# EAGLE design flanger (EAGLE 9.6.2)
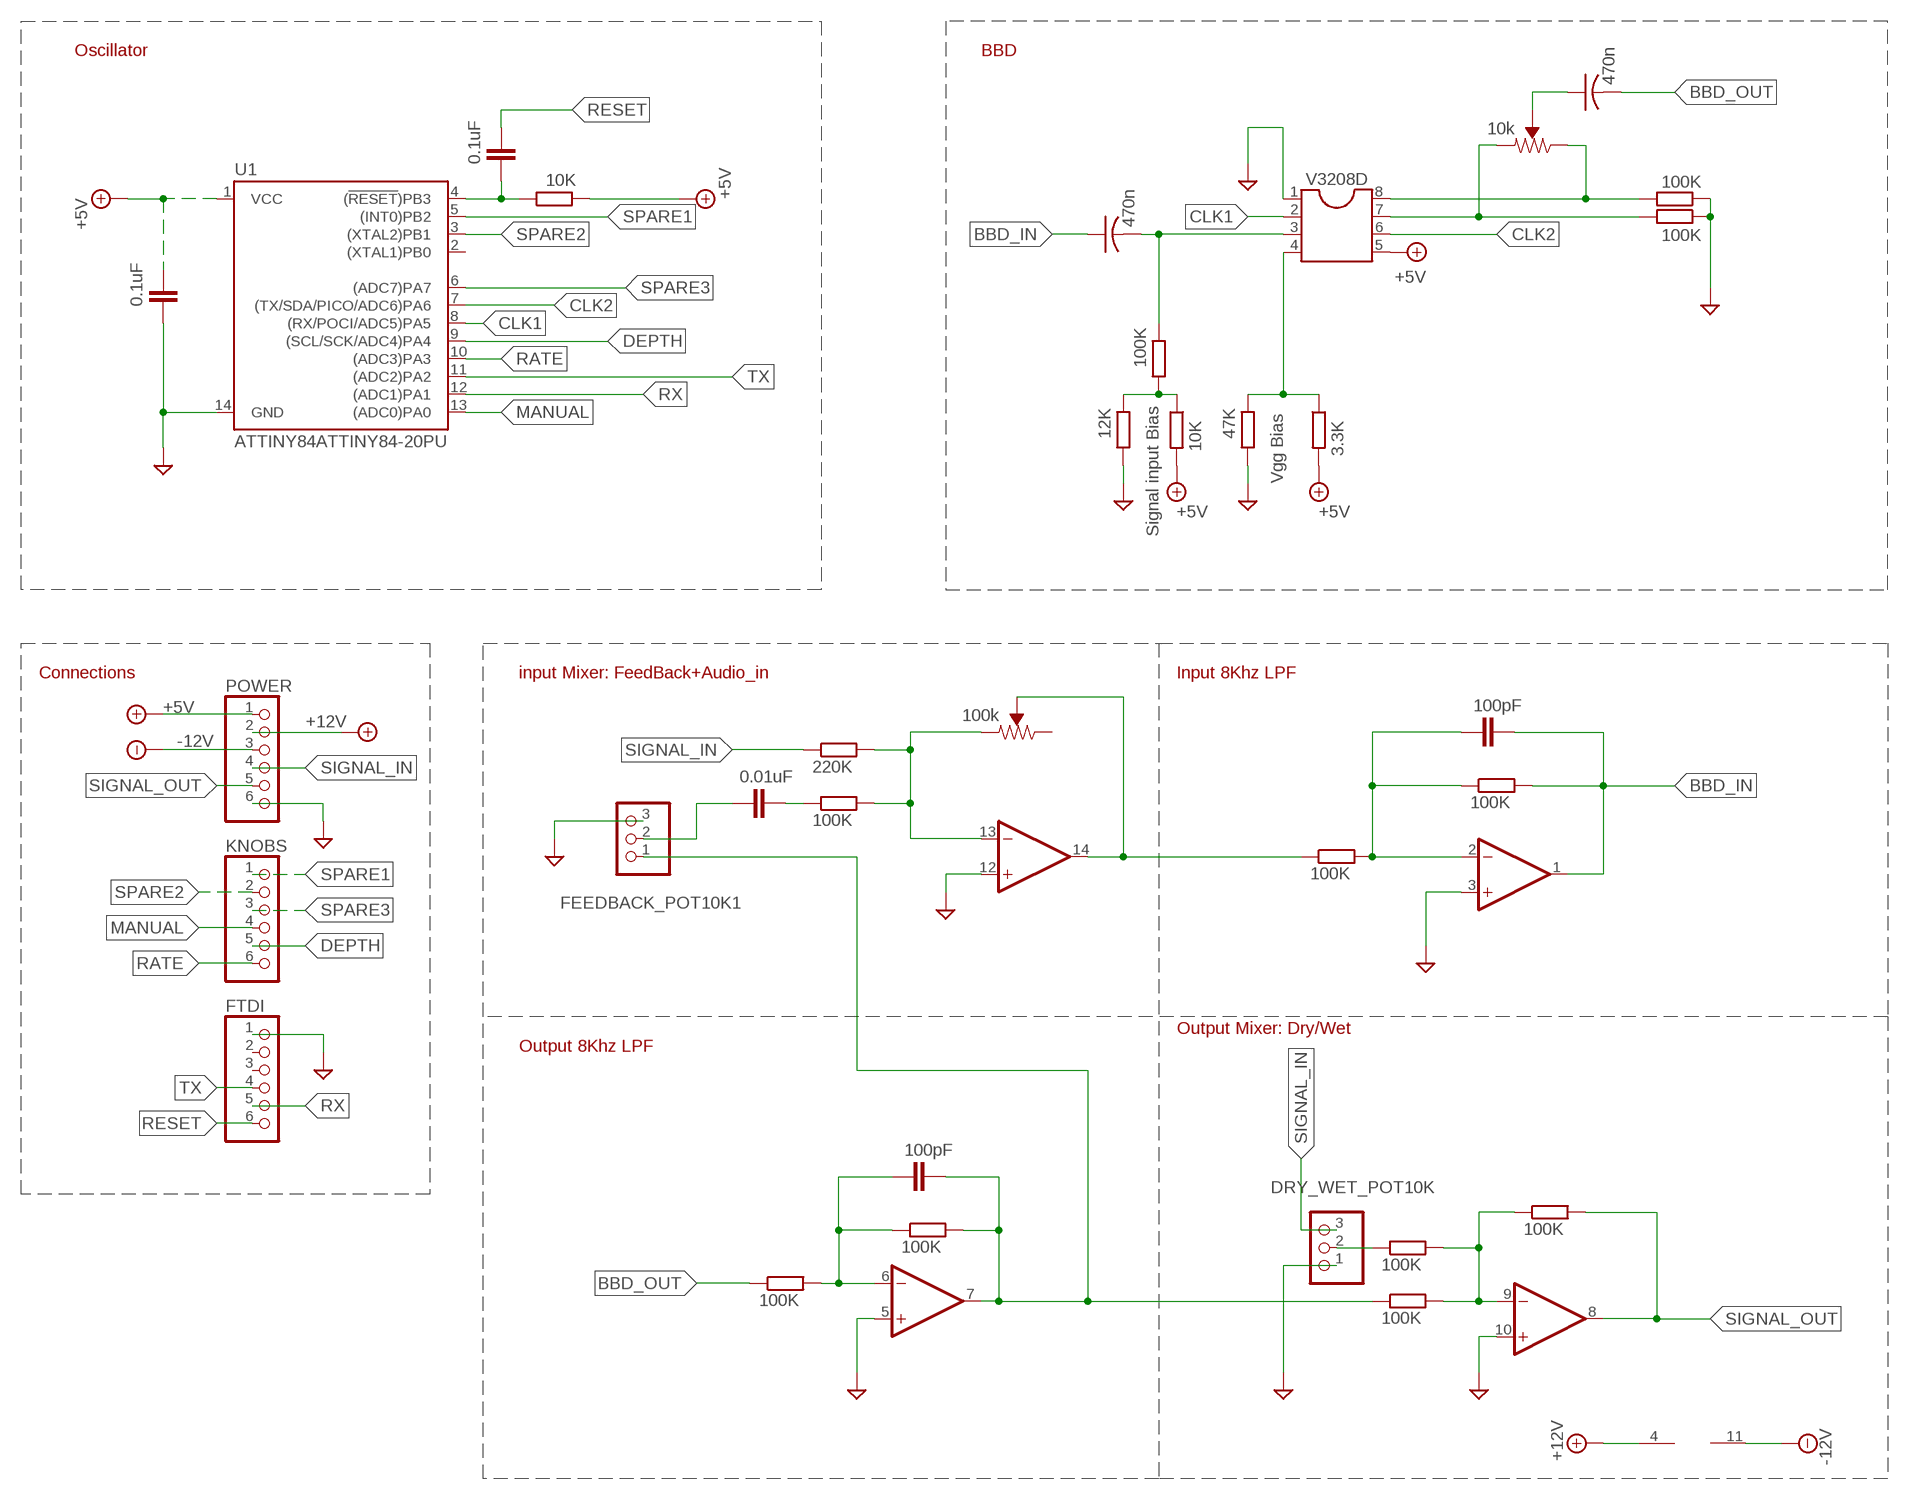
[diagram p0: schematic, sheet 1]

## Parts
C1  470n  C-US050-025X075  [C050-025X075]
C2  470n  C-US050-025X075  [C050-025X075]
C3  100pF  C5/2.5  [C5B2.5]
C4  100pF  C5/2.5  [C5B2.5]
C5  0.01uF  C5/2.5  [C5B2.5]
C6  0.1uF  C5/2.5  [C5B2.5]
C7  0.1uF  C5/2.5  [C5B2.5]
DRY_WET_POT10K  PINHD-1X3  [1X03]
FEEDBACK_POT10K1  PINHD-1X3  [1X03]
FTDI  PINHD-1X6  [1X06]
IC1  LM324N  [DIL14]
KNOBS  PINHD-1X6  [1X06]
POWER  PINHD-1X6  [1X06]
R1  12K  R-EU_0207/10  [0207/10]
R2  100K  R-EU_0207/10  [0207/10]
R3  10K  R-EU_0207/10  [0207/10]
R4  47K  R-EU_0207/10  [0207/10]
R5  3.3K  R-EU_0207/10  [0207/10]
R6  100K  R-EU_0207/10  [0207/10]
R7  100K  R-EU_0207/10  [0207/10]
R8  100K  R-EU_0207/10  [0207/10]
R9  100K  R-EU_0207/10  [0207/10]
R10  100K  R-EU_0207/10  [0207/10]
R11  100K  R-EU_0207/10  [0207/10]
R13  100K  R-EU_0207/10  [0207/10]
R14  100K  R-EU_0207/10  [0207/10]
R15  220K  R-EU_0207/10  [0207/10]
R16  100K  R-EU_0207/10  [0207/10]
R17  100K  R-EU_0207/10  [0207/10]
R18  10K  R-EU_0207/10  [0207/10]
U1  ATTINY84ATTINY84-20PU  [DIP14]
V3208D  DIL8  [DIL08]
VR1  10k  TRIMPOT-PTH-10MM-KNOB-1/2W-10%  [TRIMPOT-PTH-3386U]
VR2  100k  TRIMPOT-PTH-10MM-KNOB-1/2W-10%  [TRIMPOT-PTH-3386U]

## Nets
+5V: C6.2 POWER.1 R3.2 R5.2 R18.2 U1.1(VCC) V3208D.5
+12V: IC1.4(P:V+) POWER.2
-12V: IC1.11(P:V-) POWER.3
BBD_IN: C1.1 C3.2 IC1.1(A:OUT) R8.2
BBD_OUT: C2.2 R11.1
CLK1: U1.8((RX/POCI/ADC5)PA5) V3208D.2
CLK2: U1.7((TX/SDA/PICO/ADC6)PA6) V3208D.6
DEPTH: KNOBS.5 U1.9((SCL/SCK/ADC4)PA4)
GND: C6.1 DRY_WET_POT10K.1 FEEDBACK_POT10K1.3 FTDI.1 IC1.3(A:+IN) IC1.5(B:+IN) IC1.10(C:+IN) IC1.12(D:+IN) POWER.6 R1.1 R4.1 R6.1 R7.1 U1.14(GND) V3208D.1
MANUAL: KNOBS.4 U1.13((ADC0)PA0)
N$1: R6.2 V3208D.8 VR1.3(CW)
N$2: R7.2 V3208D.7 VR1.1(CCW)
N$3: C1.2 R2.2 V3208D.3
N$4: C2.1 VR1.2(WIPER)
N$5: R1.2 R2.1 R3.1
N$6: R4.2 R5.1 V3208D.4
N$7: IC1.13(D:-IN) R15.2 R16.2 VR2.1(CCW)
N$8: C3.1 IC1.2(A:-IN) R8.1 R9.2
N$9: C4.1 IC1.6(B:-IN) R10.1 R11.2
N$10: DRY_WET_POT10K.2 R17.1
N$11: IC1.14(D:OUT) R9.1 VR2.2(WIPER)
N$12: C4.2 FEEDBACK_POT10K1.1 IC1.7(B:OUT) R10.2 R14.1
N$13: IC1.9(C:-IN) R13.1 R14.2 R17.2
N$14: C5.2 R16.1
N$15: C5.1 FEEDBACK_POT10K1.2
N$16: C7.1 R18.1 U1.4((!RESET!)PB3)
RATE: KNOBS.6 U1.10((ADC3)PA3)
RESET: C7.2 FTDI.6
RX: FTDI.5 U1.12((ADC1)PA1)
SIGNAL_IN: DRY_WET_POT10K.3 POWER.4 R15.1
SIGNAL_OUT: IC1.8(C:OUT) POWER.5 R13.2
SPARE1: KNOBS.1 U1.5((INT0)PB2)
SPARE2: KNOBS.2 U1.3((XTAL2)PB1)
SPARE3: KNOBS.3 U1.6((ADC7)PA7)
TX: FTDI.4 U1.11((ADC2)PA2)
Unconnected: FTDI.2 FTDI.3 U1.2((XTAL1)PB0) VR2.3(CW)

## Notes on the sheet
- Oscillator | BBD
- Vgg Bias
- Signal input Bias
- Connections | input Mixer: FeedBack+Audio_in | Input 8Khz LPF
- Output Mixer: Dry/Wet
- Output 8Khz LPF

## Library data of the parts
C1 C2 = adafruit:C-US: CAPACITOR, American symbol
C3-C7 = capacitor-wima:C: CAPACITOR naming: grid - package width
DRY_WET_POT10K FEEDBACK_POT10K1 = adafruit:PINHD-1X3: PIN HEADER
FTDI KNOBS POWER = adafruit:PINHD-1X6: PIN HEADER
IC1 = linear:LM324: OP AMP
R1-R11 R13-R18 = rcl:R-EU_: RESISTOR, European symbol; SPICEPREFIX: R
U1 = SparkFun-IC-Microcontroller:ATTINY84: Atmel 14-pin 2/4/8kB flash uC Datasheet <https://cdn.sparkfun.com/datasheets/Widgets/doc8006.pdf> SparkFun Products Tiny AVR Programmer <https://www.sparkfun.com/products/11801> (PGM-11801) SparkFun Servo Trigger - Continuous Rotation <https://www.sparkfun.com/products/13872> (WIG-13872) SparkFun Servo Trigger <https://www.sparkfun.com/products/13118> (WIG-13118)
V3208D = ic-package:DIL8: Dual In Line / Socket
VR1 = SparkFun-Resistors:TRIMPOT: Trimming Potentiometer (Trimpot) Three-terminal potentiometers, with an adjustable wiper and two adjustable resistors. A pot can be used to create a configurable voltage divider, or as a variable resistor. "Trimpots" are a subset of potentiometers, usually intended for "set-and-forget" applications. They're often more delicate than standard potentiometers - rated for fewer turns. Variants PTH-KNOB - PTH Trimpot w/ finger-adjustable knob Trimpot 10K with Knob <https://www.sparkfun.com/products/9806> (COM-09806) Datasheet <http://www.sparkfun.com/datasheets/Components/General/TSR-3386.pdf> SMD-3MM-CLOSED-FRAME - SMD 3mm Square Closed-Frame Trimpot Used on e.g. EasyDriver - Stepper Motor Driver <https://www.sparkfun.com/products/12779> Datasheet <http://www.bitechnologies.com/pdfs/22.pdf> (22AR10KTR) SMD-5MM - SMD 5mm Square Closed-Frame Trimpot Used on e.g. IOIO-OTG - V2.2 <https://www.sparkfun.com/products/13613> Datasheet <http://www.vishay.com/docs/51008/ts53.pdf> (TS53YL502MR10) SMD-3MM-1/10W-25% - 3mm Square Open-Frame Trimpot Used on e.g. SparkFun Shapeoko <https://www.sparkfun.com/products/13899> Datasheet <http://www.bourns.com/docs/Product-Datasheets/TC33.pdf> (TC33X-2-103E); PROD_ID: RES-09730; SF_SKU: COM-09806
VR2 = SparkFun-Resistors:TRIMPOT: Trimming Potentiometer (Trimpot) Three-terminal potentiometers, with an adjustable wiper and two adjustable resistors. A pot can be used to create a configurable voltage divider, or as a variable resistor. "Trimpots" are a subset of potentiometers, usually intended for "set-and-forget" applications. They're often more delicate than standard potentiometers - rated for fewer turns. Variants PTH-KNOB - PTH Trimpot w/ finger-adjustable knob Trimpot 10K with Knob <https://www.sparkfun.com/products/9806> (COM-09806) Datasheet <http://www.sparkfun.com/datasheets/Components/General/TSR-3386.pdf> SMD-3MM-CLOSED-FRAME - SMD 3mm Square Closed-Frame Trimpot Used on e.g. EasyDriver - Stepper Motor Driver <https://www.sparkfun.com/products/12779> Datasheet <http://www.bitechnologies.com/pdfs/22.pdf> (22AR10KTR) SMD-5MM - SMD 5mm Square Closed-Frame Trimpot Used on e.g. IOIO-OTG - V2.2 <https://www.sparkfun.com/products/13613> Datasheet <http://www.vishay.com/docs/51008/ts53.pdf> (TS53YL502MR10) SMD-3MM-1/10W-25% - 3mm Square Open-Frame Trimpot Used on e.g. SparkFun Shapeoko <https://www.sparkfun.com/products/13899> Datasheet <http://www.bourns.com/docs/Product-Datasheets/TC33.pdf> (TC33X-2-103E); PROD_ID: RES-09730; SF_SKU: COM-09806; VALUE: 10k

## Board
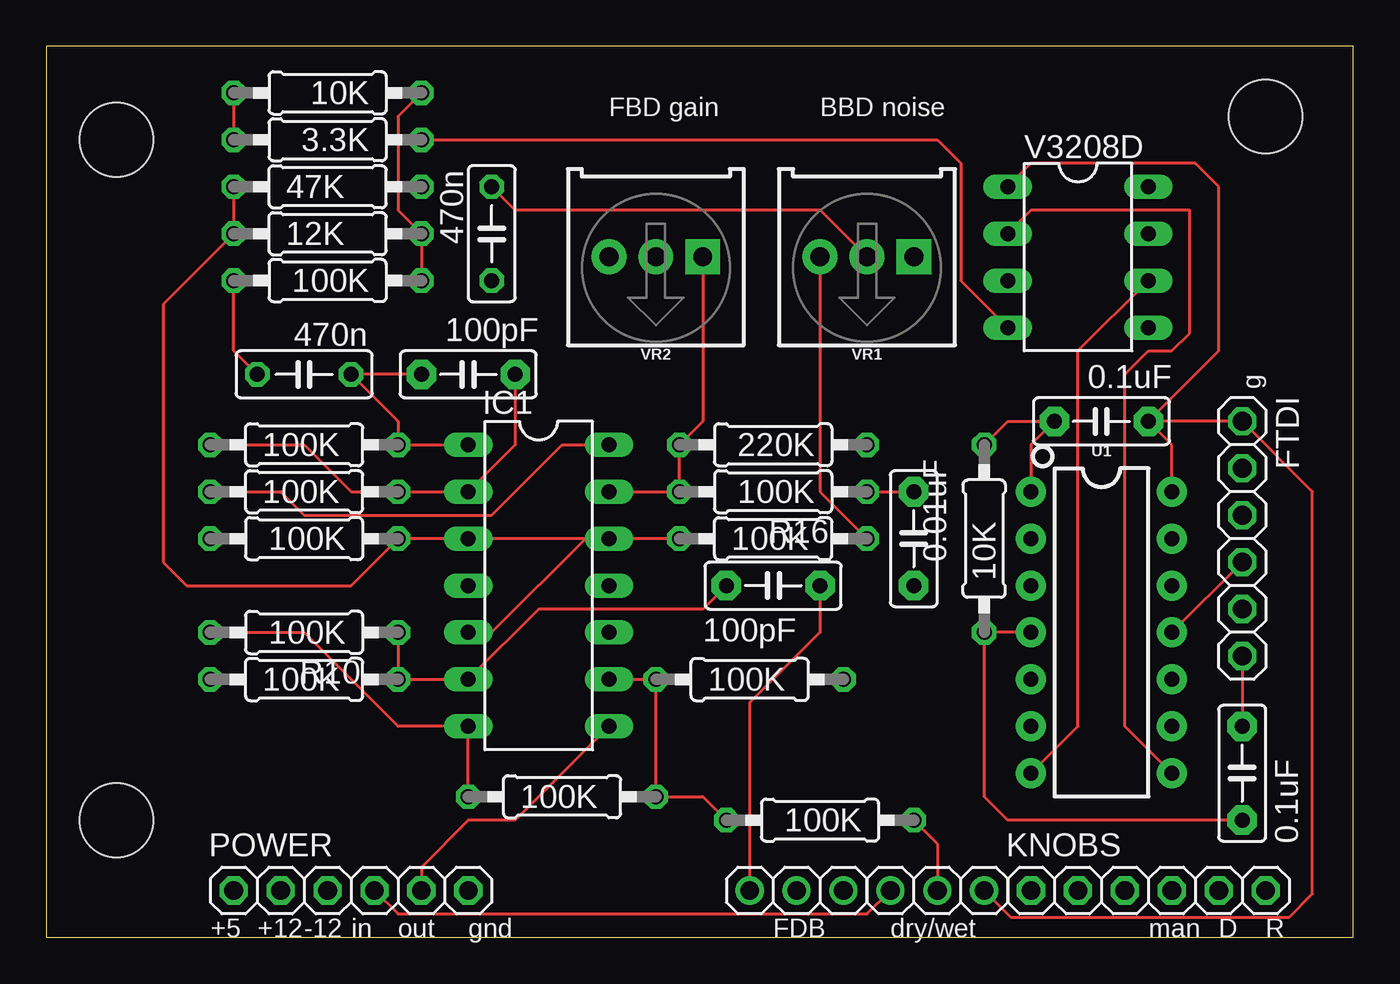
[diagram p1: board, top side]
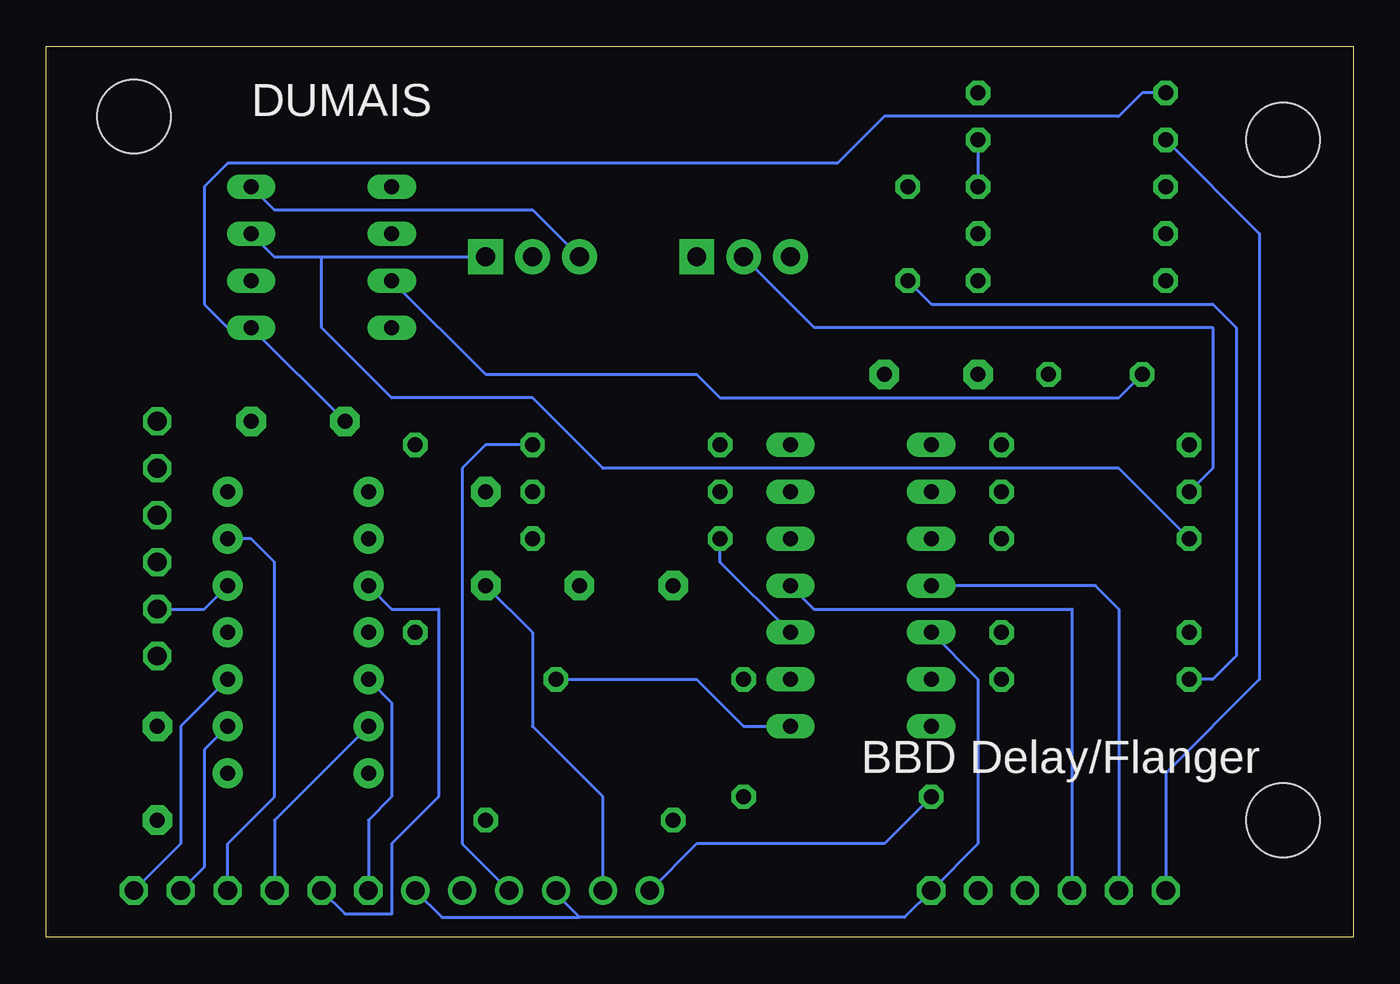
[diagram p2: board, bottom side, seen from below]

Size 70.79 x 48.25 mm. Coordinates in mm from the lower left corner, seen from the top.
Outline: 0,0 70.79,0 70.79,48.25 0,48.25 0,0
Copper layers (1*16): Top 0.035mm / dielectric 1.5mm / Bottom 0.035mm
Design rules "default": minimum track width 6mil, minimum drill 0.35mm, track to track 6mil, track to pad 6mil, pad to pad 6mil, via to via 6mil, smd to smd 6mil, copper to edge 40mil, drill to drill 6mil, minimum pad ring 10mil, minimum via ring 8mil, stop-mask expansion 4mil, vias tented up to drill 0mil, thermal gap 10mil
Holes 4 mm at 3.81,6.35 3.81,43.18 66.04,44.45

### Footprints (pad centres in the part's own frame; a part is rotated, then mirrored left to right if it is on the bottom)
C050-025X075 = drill 0.813 octagon: 1 -2.54,0; 2 2.54,0
C5B2.5 = drill 0.813 pad 1.6 octagon: 1 -2.54,0; 2 2.54,0
1X03 = drill 1.016: 1 -2.54,0; 2 0,0; 3 2.54,0
1X06 = drill 1.016 octagon: 1 -6.35,0; 2 -3.81,0; 3 -1.27,0; 4 1.27,0; 5 3.81,0; 6 6.35,0
DIL14 = drill 0.813 long: 1 -7.62,-3.81; 2 -5.08,-3.81; 3 -2.54,-3.81; 4 0,-3.81; 5 2.54,-3.81; 6 5.08,-3.81; 7 7.62,-3.81; 8 7.62,3.81; 9 5.08,3.81; 10 2.54,3.81; 11 0,3.81; 12 -2.54,3.81; 13 -5.08,3.81; 14 -7.62,3.81
0207/10 = drill 0.813 octagon: 1 -5.08,0; 2 5.08,0
DIP14 = drill 0.813 pad 1.626: 1 -7.62,-3.81; 2 -5.08,-3.81; 3 -2.54,-3.81; 4 0,-3.81; 5 2.54,-3.81; 6 5.08,-3.81; 7 7.62,-3.81; 8 7.62,3.81; 9 5.08,3.81; 10 2.54,3.81; 11 0,3.81; 12 -2.54,3.81; 13 -5.08,3.81; 14 -7.62,3.81
DIL08 = drill 0.813 long: 1 -3.81,-3.81; 2 -1.27,-3.81; 3 1.27,-3.81; 4 3.81,-3.81; 5 3.81,3.81; 6 1.27,3.81; 7 -1.27,3.81; 8 -3.81,3.81
TRIMPOT-PTH-3386U = drill 1.016 pad 1.88 square: 1 -2.54,-0.015 | drill 1.016 pad 1.88: 2 0,-0.015; 3 2.54,-0.015

### Placement (x,y rotation side)
C1  13.97,30.48 180 top
C2  24.13,38.1 270 top
C3  22.86,30.48 180 top
C4  39.37,19.05 0 top
C5  46.99,21.59 90 top
C6  57.15,27.94 180 top
C7  64.77,8.89 90 top
DRY_WET_POT10K  48.26,2.54 180 top
FEEDBACK_POT10K1  40.64,2.54 0 top
FTDI  64.77,21.59 270 top
IC1  26.67,19.05 270 top
KNOBS  59.69,2.54 0 top
POWER  16.51,2.54 0 top
R1  15.24,38.1 0 top
R2  15.24,35.56 180 top
R3  15.24,45.72 180 top
R4  15.24,40.64 0 top
R5  15.24,43.18 180 top
R6  39.37,21.59 0 top
R7  13.97,21.59 180 top
R8  13.97,26.67 0 top
R9  13.97,24.13 0 top
R10  13.97,16.51 180 top
R11  13.97,13.97 0 top
R13  38.1,13.97 0 top
R14  27.94,7.62 0 top
R15  39.37,26.67 180 top
R16  39.37,24.13 180 top
R17  41.91,6.35 180 top
R18  50.8,21.59 90 top
U1  57.15,16.51 270 top
V3208D  55.88,36.83 270 top
VR1  44.45,36.83 180 top
VR2  33.02,36.83 180 top

### Tracks (layer width: path | path; a pad name or v marks a point on that pad's centre or on a via)
+5V
  Top 0.152: U1.1 53.34,26.67 C6.2 52.07,27.94 R18.2 | R3.2 R5.2
  Bottom 0.152: R5.2 5.08,38.1 5.08,13.97 10.16,8.89 POWER.1 | C6.2 V3208D.5 60.96,33.02 62.23,34.29 62.23,40.64 60.96,41.91 27.94,41.91 25.4,44.45 12.7,44.45 11.43,45.72 R3.2
+12V
  Bottom 0.152: POWER.2 12.7,17.78 13.97,19.05 IC1.4
-12V
  Bottom 0.152: IC1.11 29.21,17.78 15.24,17.78 POWER.3
BBD_IN
  Top 0.152: IC1.1 R8.2 19.05,27.94 C1.1 C3.2
BBD_OUT
  Bottom 0.152: C2.2 22.86,34.29 7.62,34.29 6.35,33.02 6.35,15.24 7.62,13.97 R11.1
CLK1
  Top 0.152: U1.8 58.42,11.43 58.42,30.48 59.69,31.75 60.96,31.75 61.92,32.72 61.92,39.37 53.34,39.37 V3208D.2
CLK2
  Top 0.152: U1.7 55.88,11.43 55.88,31.75 V3208D.6
DEPTH
  Bottom 0.152: U1.9 62.23,10.16 62.23,3.81 KNOBS.5
GND
  Top 0.152: R6.1 IC1.12 | R4.1 R1.1 6.35,34.29 6.35,20.32 7.62,19.05 16.51,19.05 R7.1 IC1.3 IC1.12 | U1.14 60.96,26.67 C6.1 | IC1.12 29.21,21.59 24.13,16.51 IC1.5 | DRY_WET_POT10K.1 52.25,1.09 67.31,1.09 68.58,2.36 68.58,24.13 FTDI.1 C6.1 | C6.1 63.5,31.75 63.5,40.64 62.23,41.91 53.34,41.91 V3208D.1
  Bottom 0.152: IC1.10 34.29,20.32 R6.1 | 41.91,1.09 24.31,1.09 POWER.6 20.32,5.08 20.32,13.97 IC1.5 | 41.91,1.09 43.18,2.36 FEEDBACK_POT10K1.3 | DRY_WET_POT10K.1 49.35,1.09 41.91,1.09
MANUAL
  Bottom 0.152: KNOBS.4 60.96,5.08 58.42,7.62 58.42,20.32 59.69,21.59 U1.13
N$1
  Top 0.152: VR1.3 41.91,24.13 R6.2
  Bottom 0.152: VR1.3 44.44,39.37 58.42,39.37 V3208D.8
N$2
  Bottom 0.152: R7.2 12.7,25.4 40.64,25.4 44.45,29.21 52.07,29.21 55.88,33.02 55.88,36.83 | VR1.1 47.01,36.83 55.88,36.83 | V3208D.7 58.42,36.83 55.88,36.83
N$3
  Top 0.152: C1.2 10.16,31.75 R2.2
  Bottom 0.152: V3208D.3 46.99,30.48 35.56,30.48 34.29,29.21 12.7,29.21 C1.2
N$4
  Top 0.152: VR1.2 41.92,39.37 25.4,39.37 C2.1
N$5
  Top 0.152: R2.1 R1.2 19.05,39.37 19.05,44.45 R3.1
N$6
  Top 0.152: R5.1 48.26,43.18 49.53,41.91 49.53,35.56 V3208D.4
  Bottom 0.152: R5.1 R4.2
N$7
  Top 0.152: IC1.13 R16.2 R15.2 35.56,27.94 VR2.1
N$8
  Top 0.152: R8.1 13.97,26.67 16.51,24.13 R9.2 IC1.2 25.4,26.67 C3.1
N$9
  Top 0.152: C4.1 35.56,17.78 26.67,17.78 IC1.6 R11.2 R10.1
N$10
  Top 0.152: R17.1 48.26,5.08 DRY_WET_POT10K.2
N$11
  Top 0.152: R9.1 12.7,24.13 13.97,22.86 24.13,22.86 27.94,26.67 IC1.14
  Bottom 0.152: R9.1 7.62,25.4 7.62,33.02 29.2,33.02 VR2.2
N$12
  Top 0.152: R14.1 IC1.7 19.05,11.43 13.97,16.51 R10.2 | C4.2 41.91,16.51 38.1,12.7 FEEDBACK_POT10K1.1
  Bottom 0.152: R14.1 25.4,5.08 35.56,5.08 FEEDBACK_POT10K1.1
N$13
  Top 0.152: IC1.9 R13.1 R14.2 35.56,7.62 R17.2
N$14
  Top 0.152: R16.1 C5.2
N$15
  Bottom 0.152: FEEDBACK_POT10K1.2 40.64,7.62 44.45,11.43 44.45,16.51 C5.1
N$16
  Top 0.152: U1.4 R18.1 50.8,7.62 52.07,6.35 C7.1
RATE
  Bottom 0.152: U1.10 63.5,11.43 63.5,5.08 KNOBS.6
RESET
  Top 0.152: FTDI.6 C7.2
RX
  Bottom 0.152: FTDI.5 62.23,17.78 U1.12
SIGNAL_IN
  Top 0.152: POWER.4 19.05,1.27 44.45,1.27 DRY_WET_POT10K.3
  Bottom 0.152: R15.1 46.99,26.67 48.26,25.4 48.26,5.08 DRY_WET_POT10K.3
SIGNAL_OUT
  Top 0.152: IC1.8 25.4,6.35 22.86,6.35 20.32,3.81 POWER.5
  Bottom 0.152: IC1.8 33.02,11.43 35.56,13.97 R13.2
SPARE1
  Bottom 0.152: U1.5 52.07,12.7 52.07,7.62 53.34,6.35 KNOBS.1
SPARE2
  Bottom 0.152: U1.3 52.07,17.78 49.53,17.78 49.53,7.62 52.07,5.08 52.07,1.27 54.61,1.27 KNOBS.2
SPARE3
  Bottom 0.152: U1.6 58.42,6.35 KNOBS.3
TX
  Top 0.152: FTDI.4 U1.11

### Text on the board
tPlace: FBD gain | BBD noise | g | +5 | +12 | -12 | in | out | gnd | FDB | dry/wet | man | D | R
bPlace: DUMAIS | BBD Delay/Flanger